# Altium project STM32F407 Student Board.PrjPcb
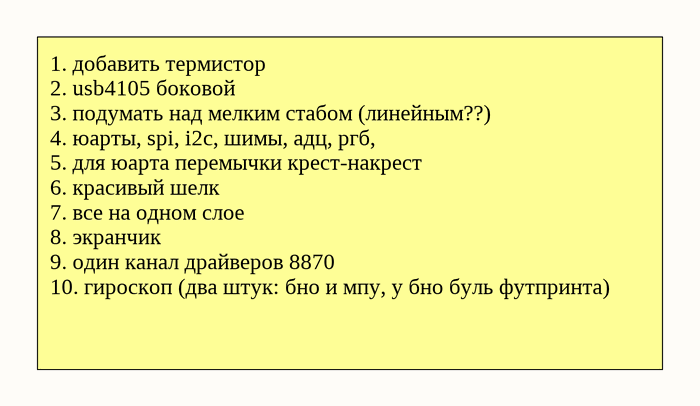
[diagram p0: main.SchDoc]
4 sheets, 49 parts. Net scope: global (net labels, ports and power ports of the same name join across sheets).
Sheets:
  main.SchDoc
  MCU.SchDoc
  ST_LINK.SchDoc
  MOTOR_DRV.SchDoc

## Sheet main.SchDoc
size A4; SheetNumber: 1; SheetTotal: 3

### Notes on the sheet
- 1. добавить термистор
  2. usb4105 боковой
  3. подумать над мелким стабом (линейным??)
  4. юарты, spi, i2c, шимы, адц, ргб,
  5. для юарта перемычки крест-накрест
  6. красивый шелк
  7. все на одном слое
  8. экранчик
  9. один канал драйверов 8870
  10. гироскоп (два штук: бно и мпу, у бно буль футпринта)

## Sheet MCU.SchDoc
size A3; SheetNumber: 2; SheetTotal: 4
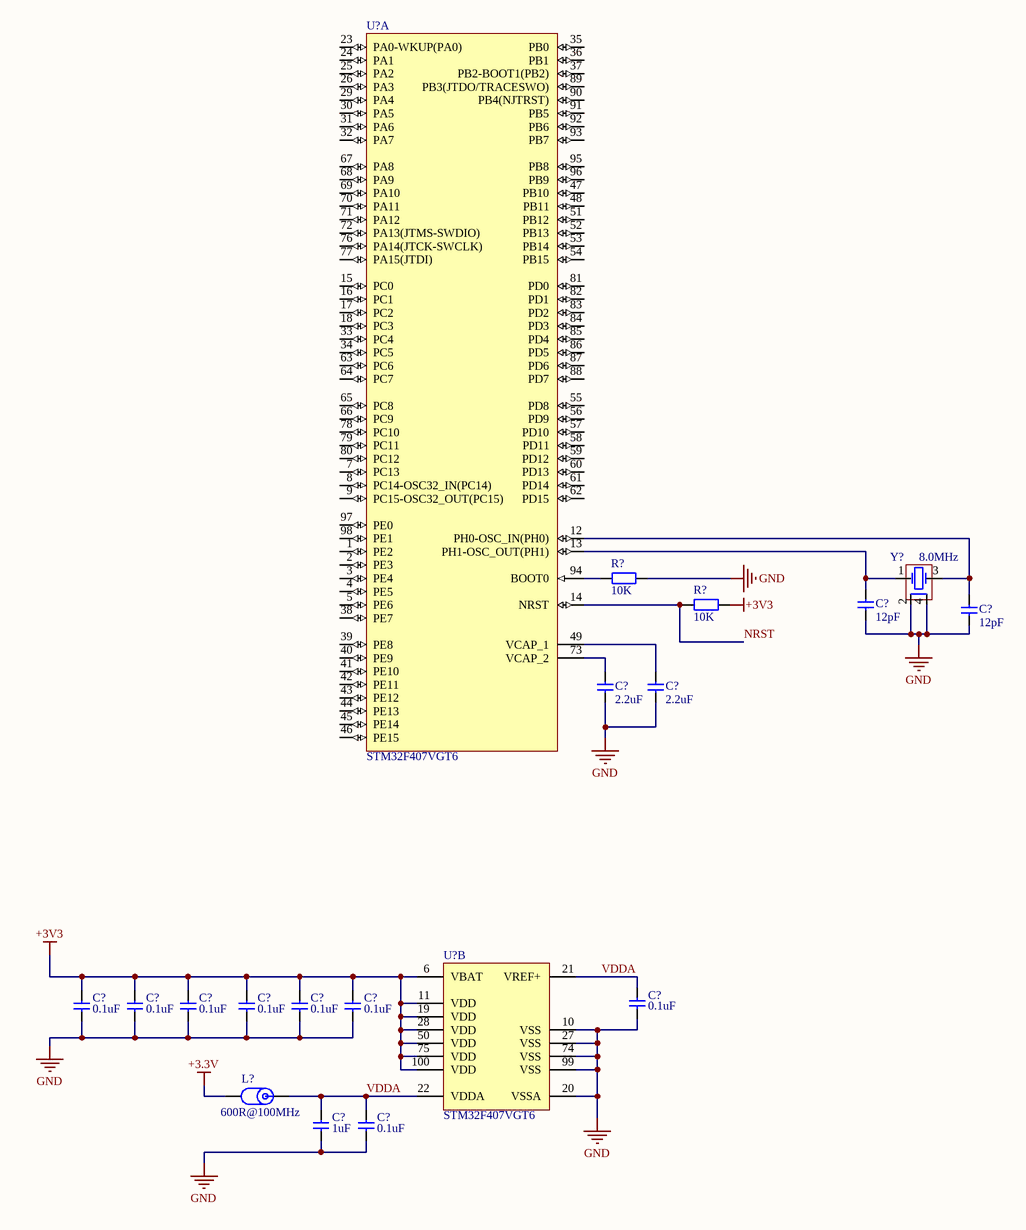
[diagram p1: MCU.SchDoc]

### Parts
(Parts that share a designator on the sheet are numbered #1, #2 ... from top to bottom, then left to right.)
C?#1  12pF  [CAP0603]
C?#2  12pF  [CAP0603]
C?#3  2.2uF  [CAP0603]
C?#4  2.2uF  [CAP0603]
C?#5  0.1uF  [CAP0603]
C?#6  0.1uF  [CAP0603]
C?#7  0.1uF  [CAP0603]
C?#8  0.1uF  [CAP0603]
C?#9  0.1uF  [CAP0603]
C?#10  0.1uF  [CAP0603]
C?#11  0.1uF  [CAP0603]
C?#12  1uF  [CAP0603]
C?#13  0.1uF  [CAP0603]
L?  600R@100MHz  [FERRITE 0603]
R?#1  10K  [RES0603]
R?#2  10K  [RES0603]
U?#1  STM32F407VGT6  [LQFP100]  (part A of 2)
U?#2  STM32F407VGT6  [LQFP100]  (part B of 2)
Y?#1  8.0MHz  [TSX-3225]

### Nets
+3.3V: L?.1
+3V3: C?#5.2 C?#6.2 C?#7.2 C?#8.2 C?#9.2 C?#10.2 R?#2.2 U?#2.6(VBAT) U?#2.11(VDD) U?#2.19(VDD) U?#2.28(VDD) U?#2.50(VDD) U?#2.75(VDD) U?#2.100(VDD)
GND: C?#1.1 C?#2.1 C?#3.1 C?#4.1 C?#5.1 C?#6.1 C?#7.1 C?#8.1 C?#9.1 C?#10.1 C?#11.1 C?#12.1 C?#13.1 R?#1.2 U?#2.10(VSS) U?#2.20(VSSA) U?#2.27(VSS) U?#2.74(VSS) U?#2.99(VSS) Y?#1.2 Y?#1.4
NRST: R?#2.1 U?#1.14(NRST)
VDDA: C?#11.2 C?#12.2 C?#13.2 L?.2 U?#2.21(VREF+) U?#2.22(VDDA)
NetC?#1_2: C?#1.2 U?#1.13(PH1-OSC_OUT(PH1)) Y?#1.1
NetC?#2_2: C?#2.2 U?#1.12(PH0-OSC_IN(PH0)) Y?#1.3
NetC?#3_2: C?#3.2 U?#1.73(VCAP_2)
NetC?#4_2: C?#4.2 U?#1.49(VCAP_1)
NetR?#1_1: R?#1.1 U?#1.94(BOOT0)

Not connected (* = marked no-connect by the designer): U?#1 1(PE2) 2(PE3) 3(PE4) 4(PE5) 5(PE6) 7(PC13) 8(PC14-OSC32_IN(PC14)) 9(PC15-OSC32_OUT(PC15)) 15(PC0) 16(PC1) 17(PC2) 18(PC3) 23(PA0-WKUP(PA0)) 24(PA1) 25(PA2) 26(PA3) 29(PA4) 30(PA5) 31(PA6) 32(PA7) 33(PC4) 34(PC5) 35(PB0) 36(PB1) 37(PB2-BOOT1(PB2)) 38(PE7) 39(PE8) 40(PE9) 41(PE10) 42(PE11) 43(PE12) 44(PE13) 45(PE14) 46(PE15) 47(PB10) 48(PB11) 51(PB12) 52(PB13) 53(PB14) 54(PB15) 55(PD8) 56(PD9) 57(PD10) 58(PD11) 59(PD12) 60(PD13) 61(PD14) 62(PD15) 63(PC6) 64(PC7) 65(PC8) 66(PC9) 67(PA8) 68(PA9) 69(PA10) 70(PA11) 71(PA12) 72(PA13(JTMS-SWDIO)) 76(PA14(JTCK-SWCLK)) 77(PA15(JTDI)) 78(PC10) 79(PC11) 80(PC12) 81(PD0) 82(PD1) 83(PD2) 84(PD3) 85(PD4) 86(PD5) 87(PD6) 88(PD7) 89(PB3(JTDO/TRACESWO)) 90(PB4(NJTRST)) 91(PB5) 92(PB6) 93(PB7) 95(PB8) 96(PB9) 97(PE0) 98(PE1)

### Library data of the parts
C?#1-C?#13 = CAP Ceramic: Ceramic SMD Cap
L? = Ferrite Bead: BLM18DN601SH1D / https://www.chipdip.ru/product/blm18dn601sh1d-ferrit-busina-imped-100mgts-600om-smd-murata-8033530814
R?#1 R?#2 = RES: RES smd
U?#1 U?#2 = STM32F407VGT6: ARM Cortex-M4 32-bit MCU+FPU, 210 DMIPS, 1024 kB Flash, 192 kB Internal RAM, 82 I/Os, 100-pin LQFP, -40 to 85 degC, Tray; Manufacturer: STMicroelectronics; D/A Converter: 2x12-bit; FLASH Size (Prog) (kB): 1024; I/Os (High Current): 82; Internal RAM Size (kB): 192; Operating Frequency(F) (Processor speed) (MHz): 168; Supply Voltage(Vcc) max (V): 3.6; Supply Voltage(Vcc) min (V): 1.8; DatasheetVersion: Rev. 4; PackageVersion: Rev. 1, 06/2013; PackageReference: LQFP100; PackageDescription: 100-Pin Low Profile Quad Flat Package, 14 x 14 mm Body, 0.5 mm Pitch; Supplier 1: Digi-Key; Supplier Part Number 1: 497-11605-ND; Supplier 2: Farnell; Supplier Part Number 2: 2064368; Supplier 3: Newark; Supplier Part Number 3: 73T2333; Supplier 4: Mouser; Supplier Part Number 4: 511-STM32F407VGT6; Core: ARM Cortex-M4; Packing: Tray; Mounting Technology: Surface Mount; PartNumber: STM32F407VGT6; ComponentLink1Description: Manufacturer URL; ComponentLink1URL: http://www.st.com/web/en/home.html; ComponentLink2Description: Datasheet; ComponentLink2URL: http://www.st.com/st-web-ui/static/active/en/resource/technical/document/datasheet/DM00037051.pdf; ComponentLink3Description: Package Specification; ComponentLink3URL: http://www.st.com/st-web-ui/static/active/en/resource/technical/document/data_brief/DM00071938.pdf
Y?#1 = Quartz

## Sheet ST_LINK.SchDoc
size A3; SheetNumber: 3; SheetTotal: 4
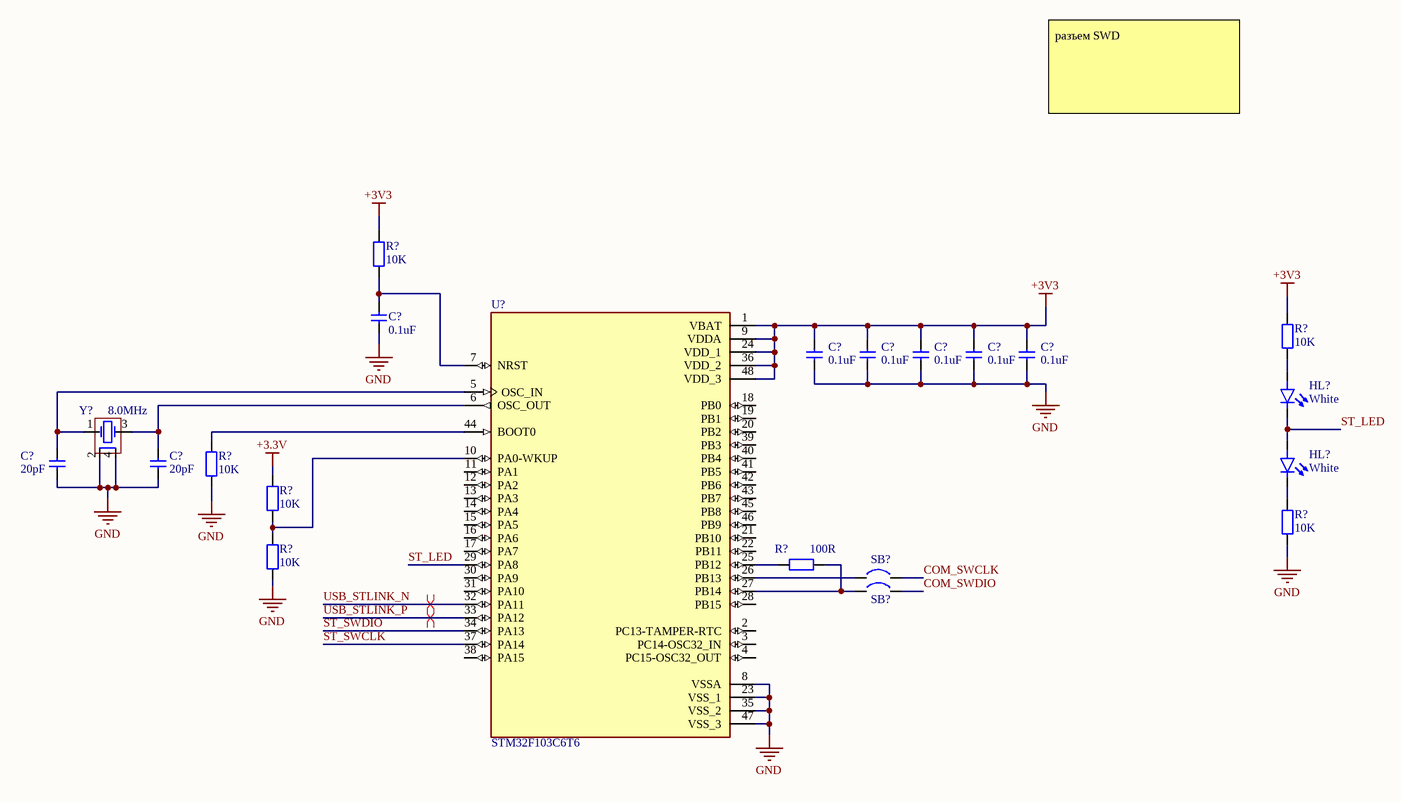
[diagram p2: ST_LINK.SchDoc]

### Parts
(Parts that share a designator on the sheet are numbered #1, #2 ... from top to bottom, then left to right.)
C?#14  0.1uF  [CAP0603]
C?#15  0.1uF  [CAP0603]
C?#16  0.1uF  [CAP0603]
C?#17  0.1uF  [CAP0603]
C?#18  0.1uF  [CAP0603]
C?#19  0.1uF  [CAP0603]
C?#20  20pF  [CAP0603]
C?#21  20pF  [CAP0603]
HL?#1  White  [LED0603_WHITE]
HL?#2  White  [LED0603_WHITE]
R?#3  10K  [RES0603]
R?#4  10K  [RES0603]
R?#5  10K  [RES0603]
R?#6  10K  [RES0603]
R?#7  10K  [RES0603]
R?#8  10K  [RES0603]
R?#9  100R  [RES0603]
SB?#1  Solder Bridge  [Solder Bridge]  (value not drawn)
SB?#2  Solder Bridge  [Solder Bridge]  (value not drawn)
U?#3  STM32F103C6T6  [LQFP48]
Y?#2  8.0MHz  [TSX-3225]

### Nets
+3.3V: R?#6.2
+3V3: C?#15.2 C?#16.2 C?#17.2 C?#18.2 C?#19.2 R?#3.2 R?#4.2 U?#3.1(VBAT) U?#3.9(VDDA) U?#3.24(VDD_1) U?#3.36(VDD_2) U?#3.48(VDD_3)
GND: C?#14.1 C?#15.1 C?#16.1 C?#17.1 C?#18.1 C?#19.1 C?#20.1 C?#21.1 R?#5.1 R?#7.1 R?#8.1 U?#3.8(VSSA) U?#3.23(VSS_1) U?#3.35(VSS_2) U?#3.47(VSS_3) Y?#2.2 Y?#2.4
COM_SWCLK: SB?#1.2
COM_SWDIO: SB?#2.2
ST_LED: HL?#1.1(K) HL?#2.2(A) U?#3.29(PA8)
ST_SWCLK: U?#3.37(PA14)
ST_SWDIO: U?#3.34(PA13)
USB_STLINK_N: U?#3.32(PA11)
USB_STLINK_P: U?#3.33(PA12)
NetC?#14_2: C?#14.2 R?#3.1 U?#3.7(NRST)
NetC?#20_2: C?#20.2 U?#3.5(OSC_IN) Y?#2.1
NetC?#21_2: C?#21.2 U?#3.6(OSC_OUT) Y?#2.3
NetHL?#1_2: HL?#1.2(A) R?#4.1
NetHL?#2_1: HL?#2.1(K) R?#7.2
NetR?#5_2: R?#5.2 U?#3.44(BOOT0)
NetR?#6_1: R?#6.1 R?#8.2 U?#3.10(PA0-WKUP)
NetR?#9_1: R?#9.1 U?#3.25(PB12)
NetR?#9_2: R?#9.2 SB?#2.1 U?#3.27(PB14)
NetSB?#1_1: SB?#1.1 U?#3.26(PB13)

Not connected (* = marked no-connect by the designer): U?#3 2(PC13-TAMPER-RTC) 3(PC14-OSC32_IN) 4(PC15-OSC32_OUT) 11(PA1) 12(PA2) 13(PA3) 14(PA4) 15(PA5) 16(PA6) 17(PA7) 18(PB0) 19(PB1) 20(PB2) 21(PB10) 22(PB11) 28(PB15) 30(PA9) 31(PA10) 38(PA15) 39(PB3) 40(PB4) 41(PB5) 42(PB6) 43(PB7) 45(PB8) 46(PB9)

### Layout directives
differential pair: USB_STLINK_N, USB_STLINK_P

### Notes on the sheet
- разъем SWD

### Library data of the parts
C?#14-C?#21 = CAP Ceramic: Ceramic SMD Cap
HL?#1 HL?#2 = LED: LED smd
R?#3-R?#9 = RES: RES smd
Y?#2 = Quartz

## Sheet MOTOR_DRV.SchDoc
size A4; SheetNumber: 4; SheetTotal: 4
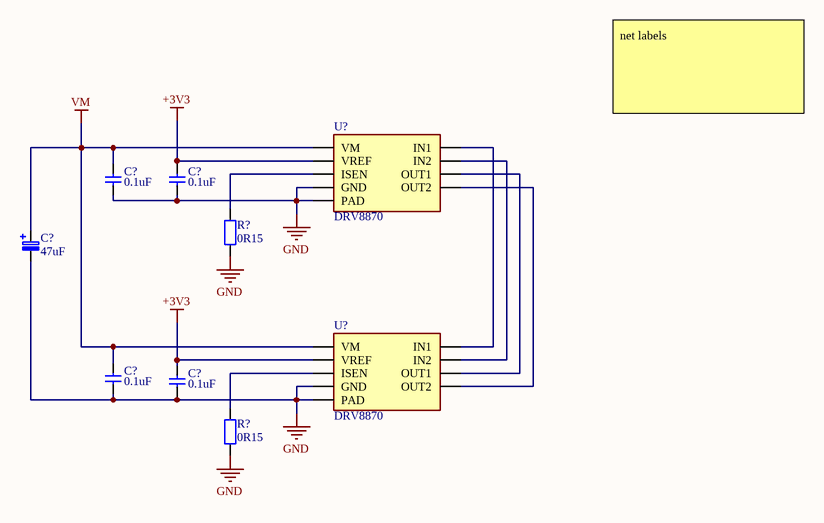
[diagram p3: MOTOR_DRV.SchDoc]

### Parts
(Parts that share a designator on the sheet are numbered #1, #2 ... from top to bottom, then left to right.)
C?#22  0.1uF  [CAP0805]
C?#23  0.1uF  [CAP0603]
C?#24  47uF  [CAP_TANT_C]
C?#25  0.1uF  [CAP0805]
C?#26  0.1uF  [CAP0603]
R?#10  0R15  [RES2512]
R?#11  0R15  [RES2512]
U?#4  DRV8870  [SOIC-8 thermal]
U?#5  DRV8870  [SOIC-8 thermal]

### Nets
+3V3: C?#23.2 C?#26.2 U?#4.4(VREF) U?#5.4(VREF)
GND: C?#22.1 C?#23.1 C?#24.1 C?#25.1 C?#26.1 R?#10.1 R?#11.1 U?#4.1(GND) U?#4.9(PAD) U?#5.1(GND) U?#5.9(PAD)
VM: C?#22.2 C?#24.2 C?#25.2 U?#4.5(VM) U?#5.5(VM)
NetR?#10_2: R?#10.2 U?#4.7(ISEN)
NetR?#11_2: R?#11.2 U?#5.7(ISEN)
NetU?#4_2: U?#4.2(IN2) U?#5.2(IN2)
NetU?#4_3: U?#4.3(IN1) U?#5.3(IN1)
NetU?#4_6: U?#4.6(OUT1) U?#5.6(OUT1)
NetU?#4_8: U?#4.8(OUT2) U?#5.8(OUT2)

### Notes on the sheet
- net labels

### Library data of the parts
C?#22 C?#23 C?#25 C?#26 = CAP Ceramic: Ceramic SMD Cap
C?#24 = CAP Tantal: Tantal SMD Cap
R?#10 R?#11 = RES: RES smd
U?#4 U?#5 = DRV8870: DC motor driver 3.6A

## Nets that join several sheets
+3.3V: MCU (L?.1), ST_LINK (R?#6.2)
+3V3: MCU (14 pins), ST_LINK (12 pins), MOTOR_DRV (C?#23.2 C?#26.2 U?#4.4 U?#5.4)
GND: MCU (21 pins), ST_LINK (17 pins), MOTOR_DRV (11 pins)